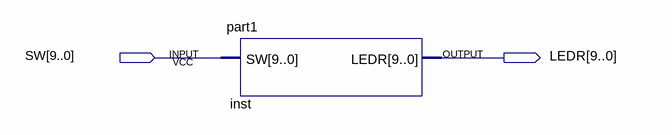
[diagram p0: schematic sheet]
// Quartus schematic part1_sch.bdf as structural Verilog: 1 symbols, 2 pins
module part1_sch (
  input  [9:0] SW,
  output [9:0] LEDR
);

  part1 inst (.SW(SW), .LEDR(LEDR));
endmodule
